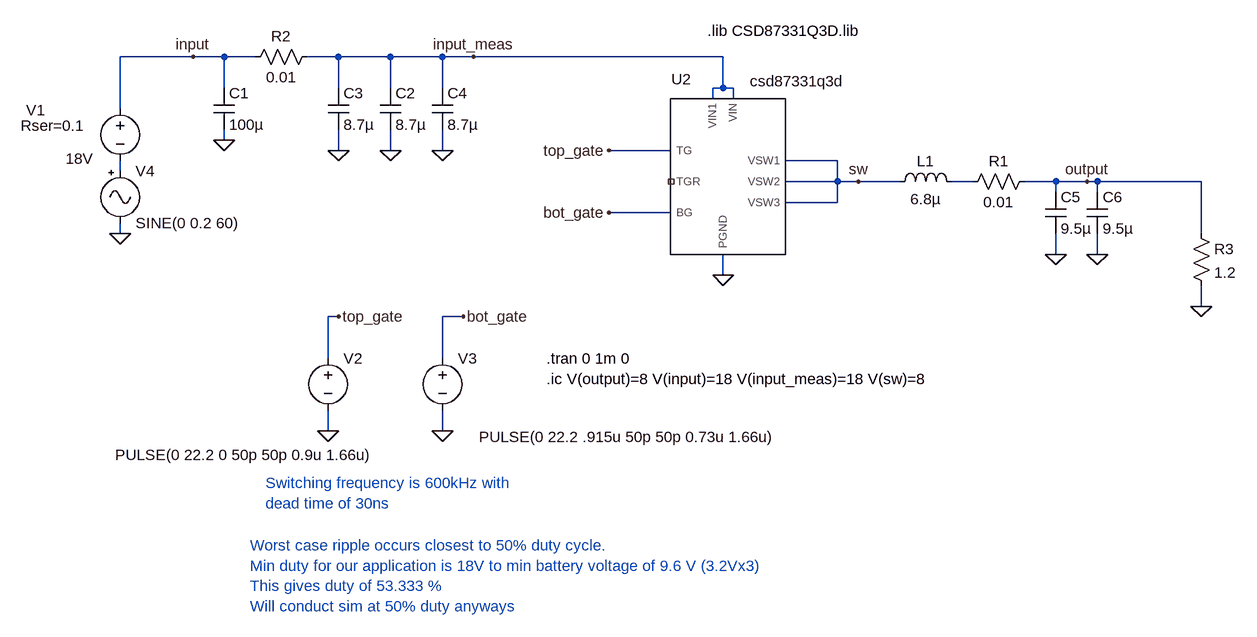
[diagram p0: schematic Draft1.asc]
Draft1.asc, the LTspice schematic file:
Version 4
SHEET 1 1132 752
WIRE -1072 -160 -1184 -160
WIRE -1024 -160 -1072 -160
WIRE -976 -160 -1024 -160
WIRE -848 -160 -896 -160
WIRE -768 -160 -848 -160
WIRE -688 -160 -768 -160
WIRE -640 -160 -688 -160
WIRE -256 -160 -640 -160
WIRE -1024 -112 -1024 -160
WIRE -848 -112 -848 -160
WIRE -768 -112 -768 -160
WIRE -688 -112 -688 -160
WIRE -256 -112 -256 -160
WIRE -256 -112 -272 -112
WIRE -240 -112 -256 -112
WIRE -272 -96 -272 -112
WIRE -240 -96 -240 -112
WIRE -1184 -80 -1184 -160
WIRE -1024 -32 -1024 -48
WIRE -848 -16 -848 -48
WIRE -768 -16 -768 -48
WIRE -688 -16 -688 -48
WIRE -336 -16 -432 -16
WIRE -80 0 -160 0
WIRE -1184 16 -1184 0
WIRE -80 32 -80 0
WIRE -80 32 -160 32
WIRE -48 32 -80 32
WIRE 16 32 -48 32
WIRE 128 32 96 32
WIRE 256 32 208 32
WIRE 304 32 256 32
WIRE 320 32 304 32
WIRE 480 32 320 32
WIRE 256 48 256 32
WIRE 320 48 320 32
WIRE -80 64 -80 32
WIRE -80 64 -160 64
WIRE -336 80 -432 80
WIRE -1184 112 -1184 96
WIRE 480 112 480 32
WIRE 256 144 256 112
WIRE 320 144 320 112
WIRE -256 176 -256 144
WIRE 480 224 480 192
WIRE -848 240 -864 240
WIRE -656 240 -688 240
WIRE -864 304 -864 240
WIRE -688 304 -688 240
WIRE -864 416 -864 384
WIRE -688 416 -688 384
FLAG -1184 112 0
FLAG -256 176 0
FLAG -432 -16 top_gate
FLAG -432 80 bot_gate
FLAG -848 240 top_gate
FLAG -656 240 bot_gate
FLAG -864 416 0
FLAG -688 416 0
FLAG 480 224 0
FLAG -688 -16 0
FLAG 256 144 0
FLAG 320 144 0
FLAG 304 32 output
FLAG -1072 -160 input
FLAG -1024 -32 0
FLAG -848 -16 0
FLAG -768 -16 0
FLAG -640 -160 input_meas
FLAG -48 32 sw
SYMBOL ind 0 48 R270
WINDOW 0 32 56 VTop 2
WINDOW 3 5 56 VBottom 2
SYMATTR InstName L1
SYMATTR Value 6.8µ
SYMATTR SpiceLine Ipk=10.5 Rser=13.3m
SYMBOL voltage -1184 -96 R0
WINDOW 0 -145 18 Left 2
WINDOW 3 -84 93 Left 2
WINDOW 123 0 0 Left 0
WINDOW 39 -153 42 Left 2
SYMATTR InstName V1
SYMATTR Value 18V
SYMATTR SpiceLine Rser=0.1
SYMBOL voltage -864 288 R0
WINDOW 3 -328 165 Left 2
WINDOW 123 0 0 Left 0
WINDOW 39 0 0 Left 0
SYMATTR Value PULSE(0 22.2 0 50p 50p 0.9u 1.66u)
SYMATTR InstName V2
SYMBOL voltage -688 288 R0
WINDOW 3 56 137 Left 2
WINDOW 123 0 0 Left 0
WINDOW 39 0 0 Left 0
SYMATTR Value PULSE(0 22.2 .915u 50p 50p 0.73u 1.66u)
SYMATTR InstName V3
SYMBOL cap -704 -112 R0
SYMATTR InstName C4
SYMATTR Value 8.7µ
SYMATTR SpiceLine Rser=4.35m
SYMBOL res 224 16 R90
WINDOW 0 0 56 VBottom 2
WINDOW 3 32 56 VTop 2
SYMATTR InstName R1
SYMATTR Value 0.01
SYMATTR SpiceLine pwr=4
SYMBOL Misc\\signal -1184 0 R0
WINDOW 123 0 0 Left 0
WINDOW 39 0 0 Left 0
SYMATTR InstName V4
SYMATTR Value SINE(0 0.2 60)
SYMBOL cap -1040 -112 R0
SYMATTR InstName C1
SYMATTR Value 100µ
SYMATTR SpiceLine V=50 Irms=475m
SYMBOL cap -784 -112 R0
SYMATTR InstName C2
SYMATTR Value 8.7µ
SYMATTR SpiceLine Rser=4.35m
SYMBOL cap -864 -112 R0
SYMATTR InstName C3
SYMATTR Value 8.7µ
SYMATTR SpiceLine Rser=4.35m
SYMBOL res -992 -144 R270
WINDOW 0 32 56 VTop 2
WINDOW 3 0 56 VBottom 2
SYMATTR InstName R2
SYMATTR Value 0.01
SYMATTR SpiceLine pwr=4
SYMBOL cap 240 48 R0
SYMATTR InstName C5
SYMATTR Value 9.5µ
SYMATTR SpiceLine Rser=4.35m
SYMBOL cap 304 48 R0
SYMATTR InstName C6
SYMATTR Value 9.5µ
SYMATTR SpiceLine Rser=4.35m
SYMBOL csd87331q3d -240 32 R0
WINDOW 0 -80 -142 Bottom 2
WINDOW 3 98 -170 Top 2
SYMATTR InstName U2
SYMBOL res 464 96 R0
SYMATTR InstName R3
SYMATTR Value 1.2
TEXT -280 -200 Left 2 !.lib CSD87331Q3D.lib
TEXT -528 304 Left 2 !.tran 0 1m 0
TEXT -960 496 Left 2 ;Switching frequency is 600kHz with\ndead time of 30ns
TEXT -984 592 Left 2 ;Worst case ripple occurs closest to 50% duty cycle.\nMin duty for our application is 18V to min battery voltage of 9.6 V (3.2Vx3)\nThis gives duty of 53.333 %\nWill conduct sim at 50% duty anyways
TEXT -528 336 Left 2 !.ic V(output)=8 V(input)=18 V(input_meas)=18 V(sw)=8

The netlist it stands for:
* Draft1.asc
L1 sw N002 6.8µ Ipk=10.5 Rser=13.3m
V1 input N001 18V Rser=0.1
V2 top_gate 0 PULSE(0 22.2 0 50p 50p 0.9u 1.66u)
V3 bot_gate 0 PULSE(0 22.2 .915u 50p 50p 0.73u 1.66u)
C4 input_meas 0 8.7µ Rser=4.35m
R1 output N002 0.01 pwr=4
V4 N001 0 SINE(0 0.2 60)
C1 input 0 100µ V=50 Irms=475m
C2 input_meas 0 8.7µ Rser=4.35m
C3 input_meas 0 8.7µ Rser=4.35m
R2 input input_meas 0.01 pwr=4
C5 output 0 9.5µ Rser=4.35m
C6 output 0 9.5µ Rser=4.35m
XU2 input_meas input_meas top_gate NC_01 bot_gate sw sw sw 0 csd87331q3d  ; pins VIN1 VIN TG TGR BG VSW1 VSW2 VSW3 PGND
R3 output 0 1.2
.lib CSD87331Q3D.lib
.tran 0 1m 0
* Switching frequency is 600kHz with
* dead time of 30ns
* Worst case ripple occurs closest to 50% duty cycle.
* Min duty for our application is 18V to min battery voltage of 9.6 V (3.2Vx3)
* This gives duty of 53.333 %
* Will conduct sim at 50% duty anyways
.ic V(output)=8 V(input)=18 V(input_meas)=18 V(sw)=8
.lib C:\Users\Frank Walsh\Documents\GitHub\AUV-Senior-Design\Frank\chum-bucket\Sims\Battery Charger Buck\CSD87331Q3D.lib
.backanno
.end